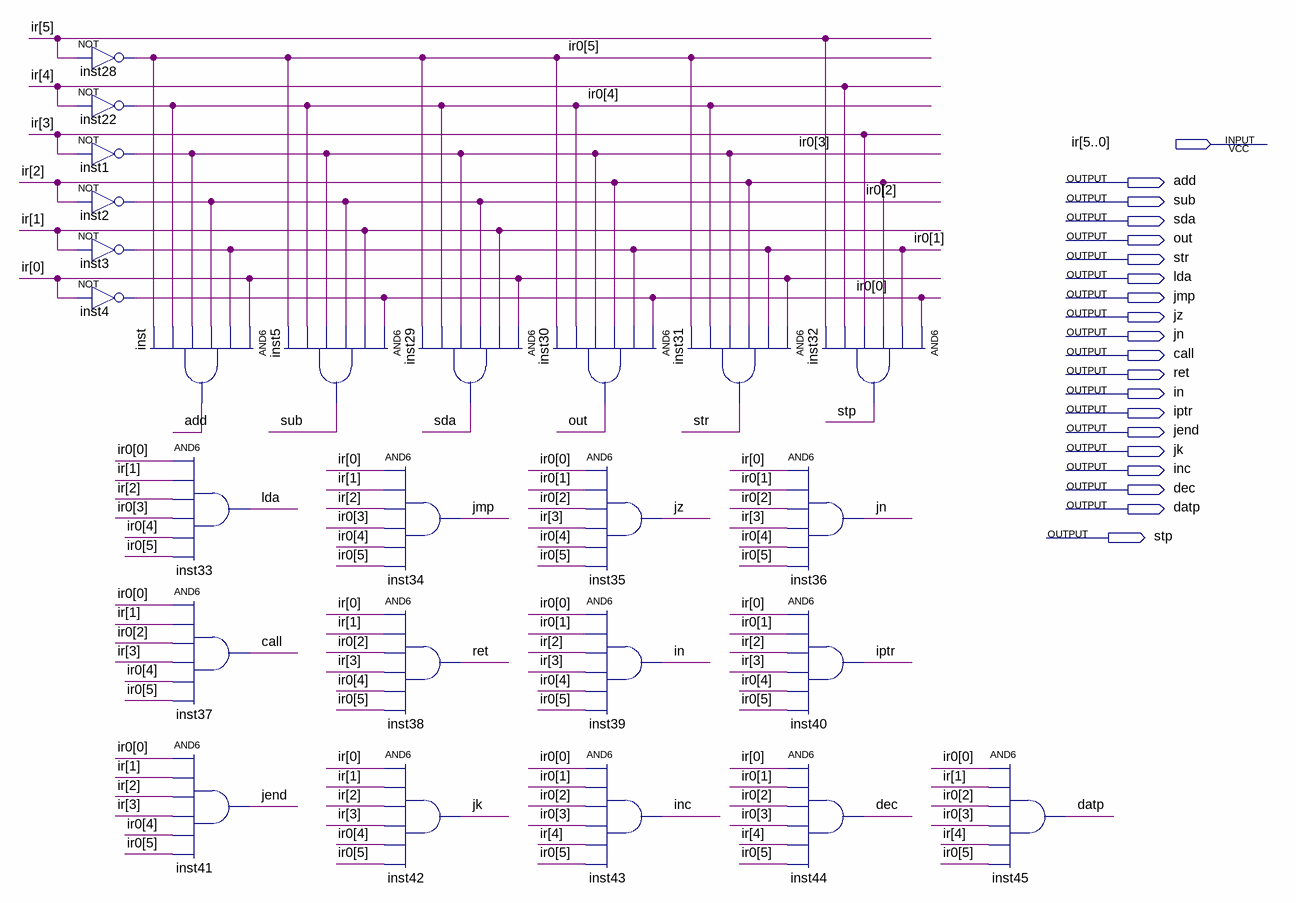
[diagram p0: schematic sheet]
// Quartus schematic zhlymq.bdf as structural Verilog: 25 symbols, 20 pins
module zhlymq (
  input  [5:0] ir,
  output add,
  output sub,
  output sda,
  output out,
  output str,
  output lda,
  output jmp,
  output jz,
  output jn,
  output call,
  output ret,
  output in,
  output iptr,
  output jend,
  output jk,
  output inc,
  output dec,
  output datp,
  output stp
);

  wire [5:0] ir0;

  not inst28 (ir0[5], ir[5]);
  not inst22 (ir0[4], ir[4]);
  not inst1 (ir0[3], ir[3]);
  not inst2 (ir0[2], ir[2]);
  not inst3 (ir0[1], ir[1]);
  not inst4 (ir0[0], ir[0]);
  and inst (add, ir[0], ir0[1], ir0[2], ir0[3], ir0[4], ir0[5]);
  and inst33 (lda, ir0[0], ir[1], ir[2], ir0[3], ir0[4], ir0[5]);
  and inst37 (call, ir0[0], ir[1], ir0[2], ir[3], ir0[4], ir0[5]);
  and inst41 (jend, ir0[0], ir[1], ir[2], ir[3], ir0[4], ir0[5]);
  and inst5 (sub, ir0[0], ir[1], ir0[2], ir0[3], ir0[4], ir0[5]);
  and inst34 (jmp, ir[0], ir[1], ir[2], ir0[3], ir0[4], ir0[5]);
  and inst38 (ret, ir[0], ir[1], ir0[2], ir[3], ir0[4], ir0[5]);
  and inst42 (jk, ir[0], ir[1], ir[2], ir[3], ir0[4], ir0[5]);
  and inst29 (sda, ir[0], ir[1], ir0[2], ir0[3], ir0[4], ir0[5]);
  and inst30 (out, ir0[0], ir0[1], ir[2], ir0[3], ir0[4], ir0[5]);
  and inst35 (jz, ir0[0], ir0[1], ir0[2], ir[3], ir0[4], ir0[5]);
  and inst39 (in, ir0[0], ir0[1], ir[2], ir[3], ir0[4], ir0[5]);
  and inst43 (inc, ir0[0], ir0[1], ir0[2], ir0[3], ir[4], ir0[5]);
  and inst31 (str, ir[0], ir0[1], ir[2], ir0[3], ir0[4], ir0[5]);
  and inst32 (stp, ir0[0], ir0[1], ir[2], ir[3], ir[4], ir[5]);
  and inst36 (jn, ir[0], ir0[1], ir0[2], ir[3], ir0[4], ir0[5]);
  and inst40 (iptr, ir[0], ir0[1], ir[2], ir[3], ir0[4], ir0[5]);
  and inst44 (dec, ir[0], ir0[1], ir0[2], ir0[3], ir[4], ir0[5]);
  and inst45 (datp, ir0[0], ir[1], ir0[2], ir0[3], ir[4], ir0[5]);
endmodule
